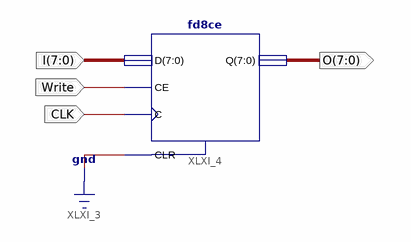
[diagram p0: schematic sheet 1]
// Xilinx ISE schematic reg8.sch (spartan3e) as structural Verilog: 1 symbols, 4 ports
module reg8 (
  input  [7:0] I,
  input  Write,
  input  CLK,
  output [7:0] O
);

  fd8ce XLXI_4 (.CLR(1'b0), .C(CLK), .CE(Write), .D(I), .Q(O));
endmodule
